# EasyEDA schematic SCH_smart golf ball v2_2024-06-10.json
TITLE: Sheet_1; REV: 1.0; Date: 2024-01-23; Sheet: 1/1; Drawn By: youssefokab; Company: Your Company
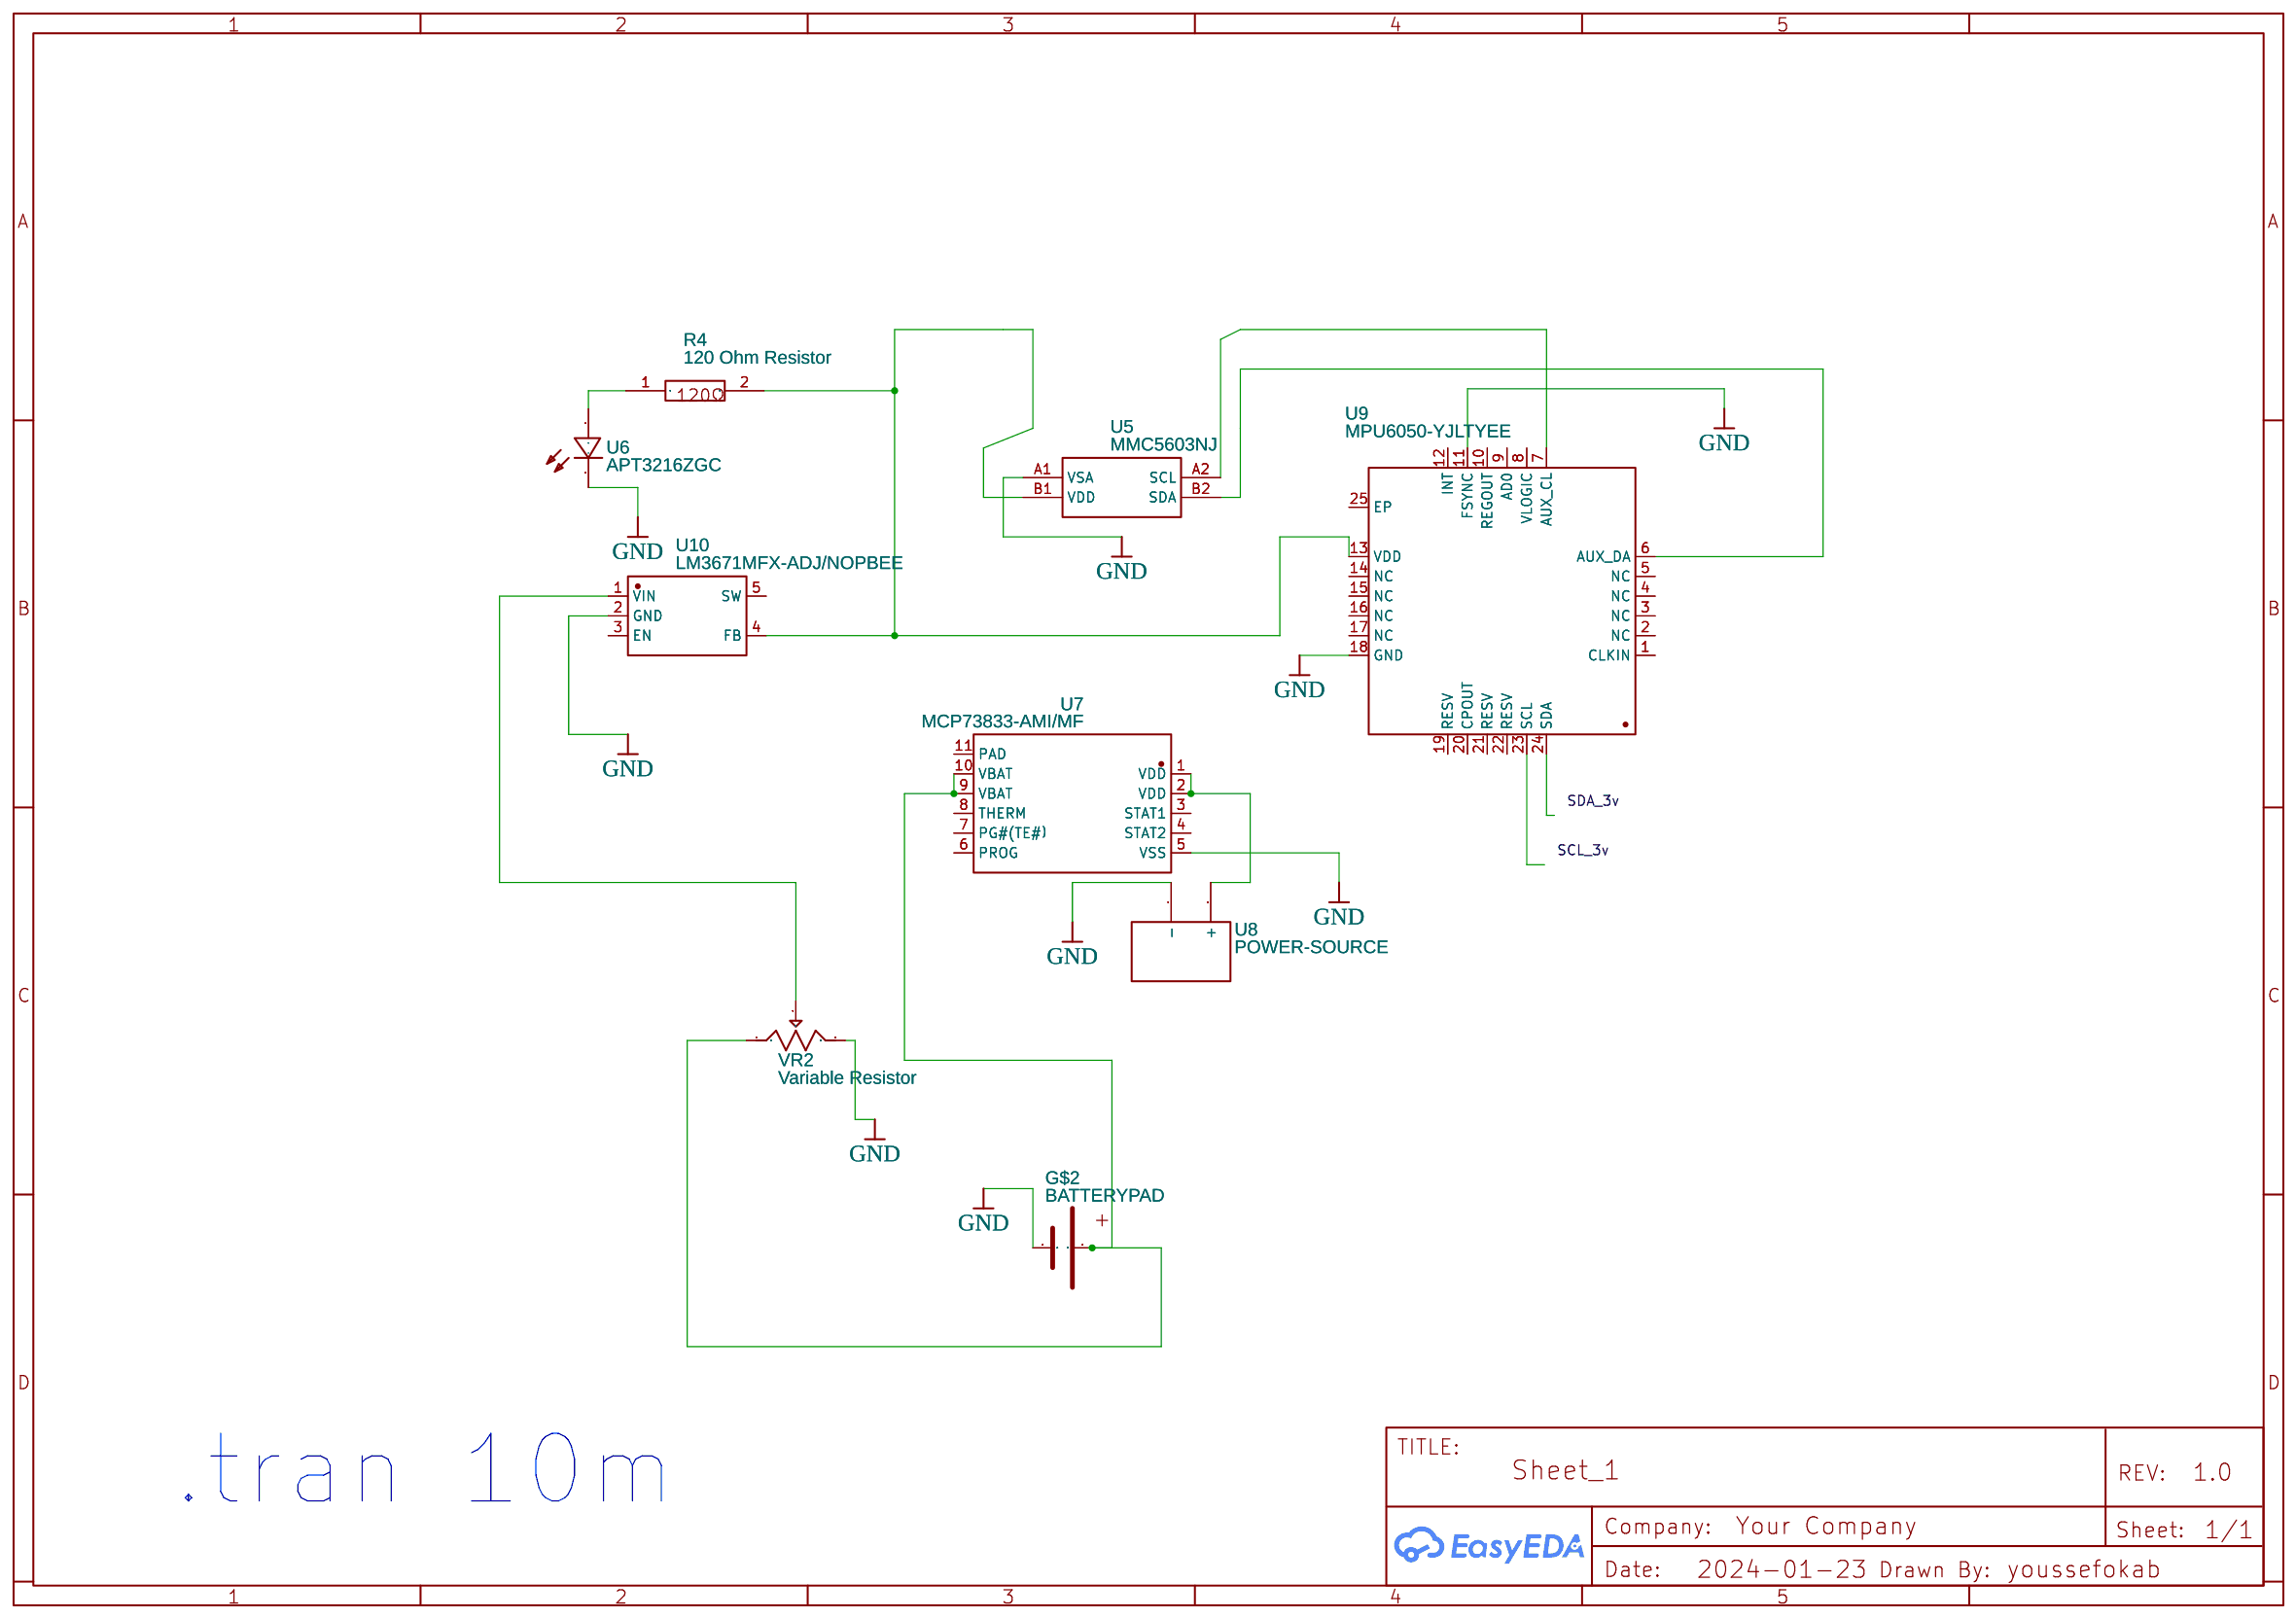
[diagram p0: schematic sheet]

## Parts
G$2  BATTERYPAD  [BATTERYPAD]
R4  120 Ohm Resistor  [120 OHM RESISTOR]
U5  MMC5603NJ  [FLIPCHIP-4_L0.8-W0.8-R2-C2-P0.40-TL]
U6  APT3216ZGC  [LED1206-RD]
U7  MCP73833-AMI/MF  [DFN-10_L3.0-W3.0-P0.50-BL-EP-1]
U8  POWER-SOURCE  [TERMINALBLOCK]
U9  MPU6050-YJLTYEE  [QFN-24_L4.0-W4.0-P0.50-BL-EP2.7]
U10  LM3671MFX-ADJ/NOPBEE  [SOT-23-5_L2.9-W1.6-P0.95-LS2.8-BR]
VR2  Variable Resistor  [VARIABLE RESISTOR]

## Library data of the parts
G$2 = BATTERYPAD: Contributor: Codyjacobs54
R4 = 120 Ohm Resistor: Contributor: mrmatthewl
U5 = MMC5603NJ: Contributor: LCSC; Supplier: LCSC; Supplier Part: C404328; Manufacturer: MEMSIC(美新); JLCPCB Part Class: Extended Part
U6 = APT3216ZGC: Contributor: lcsc; Supplier: LCSC; Supplier Part: C5875761; Manufacturer: Kingbright
U7 = MCP73833-AMI/MF: Contributor: lcsc; Supplier: LCSC; Supplier Part: C635264; Manufacturer: MICROCHIP(美国微芯); JLCPCB Part Class: Extended Part
U8 = POWER-SOURCE: Contributor: alexafragosoo
U9 = MPU6050-YJLTY: Contributor: LCSC; Supplier: LCSC; Supplier Part: C2912107; Manufacturer: null; JLCPCB Part Class: Extended Part
U10 = LM3671MFX-ADJ/NOPB: Contributor: lcsc; Supplier: LCSC; Supplier Part: C2650329; Manufacturer: TI(德州仪器)
VR2 = Variable Resistor: Manufacturer Part: x1; Contributor: abdouu

## Nets
GND: G$2.-VE U5.A1(VSA) U6.1(-) U7.5(VSS) U8.1(-) U9.11(FSYNC) U9.18(GND) U10.2(GND) VR2.3
Net-(G$2-+VE): G$2.+VE U7.9(VBAT) U7.10(VBAT) VR2.1
Net-(R4-1): R4.1 U6.2(+)
Net-(R4-2): R4.2 U5.B1(VDD) U9.13(VDD) U10.4(FB)
Net-(U5-A2): U5.A2(SCL) U9.7(AUX_CL)
Net-(U5-B2): U5.B2(SDA) U9.6(AUX_DA)
Net-(U7-1): U7.1(VDD) U7.2(VDD) U8.2(+)
Net-(U10-1): U10.1(VIN) VR2.2

Not connected (* = marked no-connect by the designer): U7 3(STAT1) 4(STAT2) 6(PROG) 7(PG#(TE#）) 8(THERM) 11(PAD); U9 1(CLKIN) 2(NC) 3(NC) 4(NC) 5(NC) 8(VLOGIC) 9(AD0) 10(REGOUT) 12(INT) 14(NC) 15(NC) 16(NC) 17(NC) 19(RESV) 20(CPOUT) 21(RESV) 22(RESV) 23(SCL) 24(SDA) 25(EP); U10 3(EN) 5(SW)

## Notes on the sheet
- .tran 10m
